# Altium project motor driver.PrjPcb
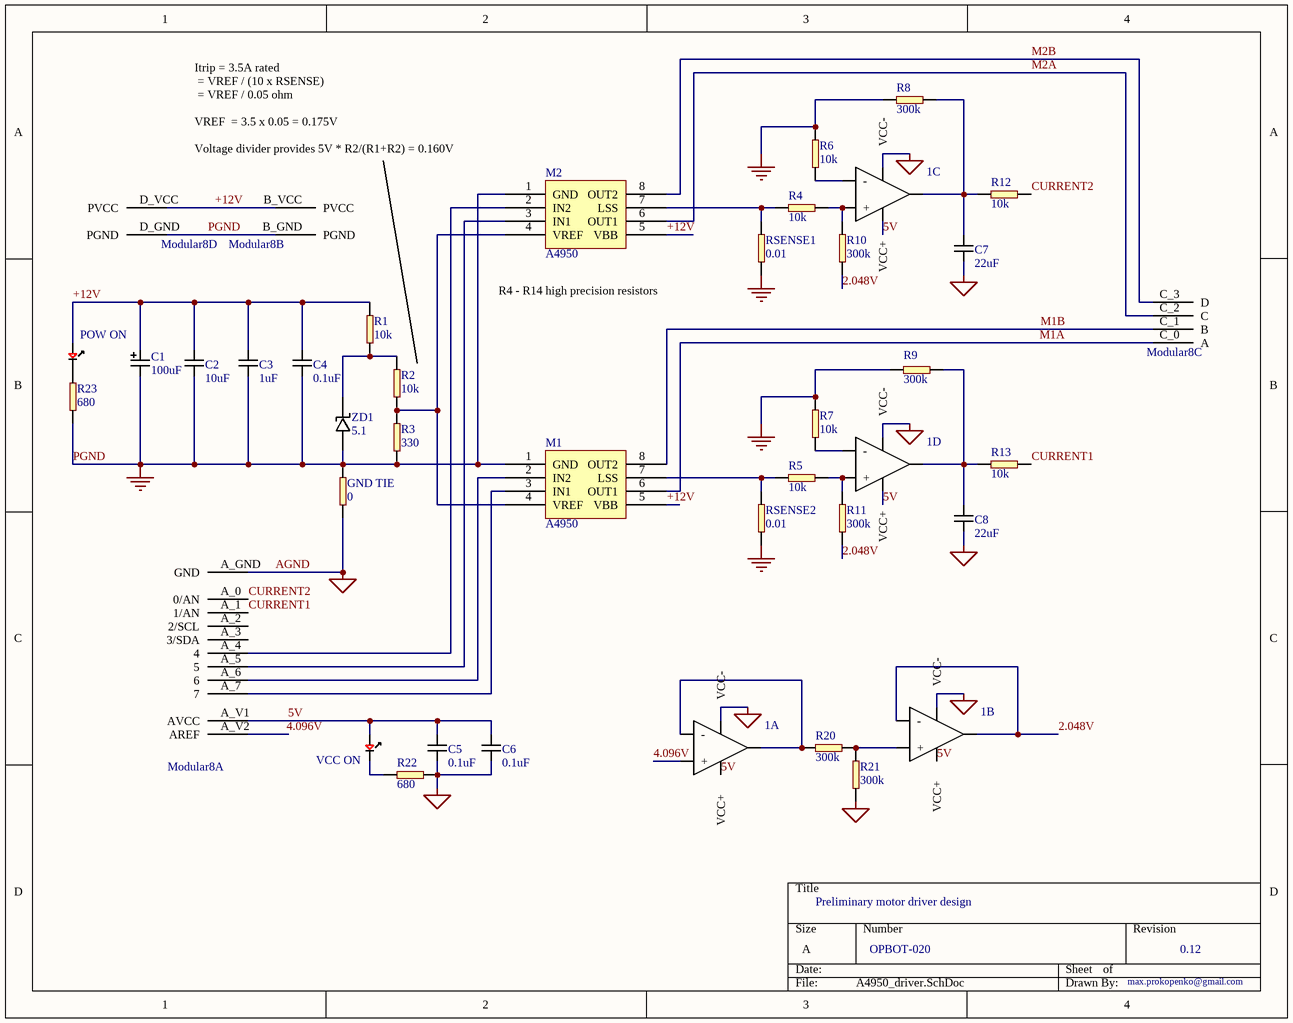
[diagram p0: A4950_driver.SchDoc]
1 sheet, 35 parts. Net scope: global (net labels, ports and power ports of the same name join across sheets).
Board file: motor_driver_002.PcbDoc

## Sheet A4950_driver.SchDoc
size A

### Parts
1  LM324DT  [SO14]  (value not drawn)  (parts A,B,C,D of 4)
C1  C: 100uF  [RADIAL CAP 6.5mm]  (hidden comment: C 100uF 25V)
C2  C: 10uF  [0603]  (hidden comment: C 10uF 25V)
C3  C: 1uF  [0603]  (hidden comment: C 1uF 25V)
C4  C: 0.1uF  [0603]  (hidden comment: C 0.1uF 25V)
C5  C: 0.1uF  [0603]  (hidden comment: C 0.1uF 25V)
C6  C: 0.1uF  [0603]  (hidden comment: C 0.1uF 25V)
C7  C: 22uF  [0603]  (hidden comment: C 22uF 6.3V)
C8  C: 22uF  [0603]  (hidden comment: C 22uF 6.3V)
GND_TIE  R: 0  [0603]  (hidden comment: R 0)
M1  A4950  [SOICN8 thermal pad]
M2  A4950  [SOICN8 thermal pad]
Modular8  modular8_power  [modular8 metric power]  (value not drawn)  (parts A,B,C,D of 4)
POW_ON  LEDG  [0805 - LED]  (value not drawn)
R1  R: 10k  [0603]  (hidden comment: R 10k)
R2  R: 10k  [0603]  (hidden comment: R 10k)
R3  R: 330  [0603]  (hidden comment: R 330)
R4  R: 10k  [0603]  (hidden comment: R 10k 1%)
R5  R: 10k  [0603]  (hidden comment: R 10k 1%)
R6  R: 10k  [0603]  (hidden comment: R 10k 1%)
R7  R: 10k  [0603]  (hidden comment: R 10k 1%)
R8  R: 300k  [0603]  (hidden comment: R 300k 1%)
R9  R: 300k  [0603]  (hidden comment: R 300k 1%)
R10  R: 300k  [0603]  (hidden comment: R 300k 1%)
R11  R: 300k  [0603]  (hidden comment: R 300k 1%)
R12  R: 10k  [0603]  (hidden comment: R 10k)
R13  R: 10k  [0603]  (hidden comment: R 10k)
R20  R: 300k  [0603]  (hidden comment: R 300k 1%)
R21  R: 300k  [0603]  (hidden comment: R 300k 1%)
R22  R: 680  [0603]  (hidden comment: R 680)
R23  R: 680  [0603]  (hidden comment: R 680)
RSENSE1  R: 0.01  [1206 SPLIT]  (hidden comment: R 0.01 0.5%)
RSENSE2  R: 0.01  [1206 SPLIT]  (hidden comment: R 0.01 0.5%)
VCC_ON  LEDG  [0805 - LED]  (value not drawn)
ZD1  Voltage: 5.1  [SOD-323F]  (hidden comment: Zener 5.1V)

### Nets
AGND: 1.11(VCC-) C5.2 C6.2 C7.2 C8.2 GND_TIE.2 Modular8.A_GND(GND) R21.2 R22.2
PGND: C1.2 C2.2 C3.2 C4.2 GND_TIE.1 M1.1(GND) M2.1(GND) Modular8.B_GND(PGND) Modular8.D_GND(PGND) R3.2 R6.2 R7.2 R8.1 R9.1 R23.2 RSENSE1.2 RSENSE2.2 ZD1.2
2.048V: 1.6(-) 1.7(OUT) R10.2 R11.2
4.096V: 1.3(+) Modular8.A_V2(AREF)
5V: 1.4(VCC+) C5.1 C6.1 Modular8.A_V1(AVCC) VCC_ON.1(A)
+12V: C1.1 C2.1 C3.1 C4.1 M1.5(VBB) M2.5(VBB) Modular8.B_VCC(PVCC) Modular8.D_VCC(PVCC) POW_ON.1(A) R1.1
CURRENT1: Modular8.A_1(1/AN) R13.2
CURRENT2: Modular8.A_0(0/AN) R12.2
M1A: M1.6(OUT1) Modular8.C_0(A)
M1B: M1.8(OUT2) Modular8.C_1(B)
M2A: M2.6(OUT1) Modular8.C_2(C)
M2B: M2.8(OUT2) Modular8.C_3(D)
Net1_1: 1.1(OUT) 1.2(-) R20.2
Net1_5: 1.5(+) R20.1 R21.1
Net1_8: 1.8(OUT) C7.1 R8.2 R12.1
Net1_9: 1.9(-) R6.1
Net1_10: 1.10(+) R4.2 R10.1
Net1_12: 1.12(+) R5.2 R11.1
Net1_13: 1.13(-) R7.1
Net1_14: 1.14(OUT) C8.1 R9.2 R13.1
NetM1_2: M1.2(IN2) Modular8.A_6(6)
NetM1_3: M1.3(IN1) Modular8.A_7(7)
NetM1_4: M1.4(VREF) M2.4(VREF) R2.2 R3.1
NetM1_7: M1.7(LSS) R5.1 RSENSE2.1
NetM2_2: M2.2(IN2) Modular8.A_4(4)
NetM2_3: M2.3(IN1) Modular8.A_5(5)
NetM2_7: M2.7(LSS) R4.1 RSENSE1.1
NetPOW_ON_2: POW_ON.2(K) R23.1
NetR1_2: R1.2 R2.1 ZD1.1
NetR22_1: R22.1 VCC_ON.2(K)

Not connected (* = marked no-connect by the designer): Modular8 A_2(2/SCL) A_3(3/SDA)

### Notes on the sheet
- Itrip	= 3.5A rated
  = VREF / (10 x RSENSE)
  = VREF / 0.05 ohm
  VREF 	= 3.5 x 0.05 = 0.175V
  Voltage divider provides 5V * R2/(R1+R2) = 0.160V
- R4 - R14 high precision resistors
- Preliminary motor driver design
- OPBOT-020
- 0.12
- max.prokopenko@gmail.com

### Library data of the parts
1 = LM324DT: Supplier 1: Digi-Key; Supplier Part Number 1: 497-1580-1-ND
C1 = C 100uF 25V: Supplier 1: Digi-Key; Supplier Part Number 1: PCE3898CT-ND; Supplier 2: Allied; Supplier Part Number 2: 70257965
C2 = C 10uF 25V: Supplier 1: Digi-Key; Supplier Part Number 1: 445-9015-1-ND
C3 = C 1uF 25V: Supplier 1: Digi-Key; Supplier Part Number 1: 1276-1858-1-ND
C4-C6 = C 0.1uF 25V: Supplier 1: Digi-Key; Supplier Part Number 1: 445-1316-1-ND
C7 C8 = C 22uF 6.3V: Supplier 1: Digi-Key; Supplier Part Number 1: 1276-1193-1-ND
GND_TIE = R 0: Supplier 1: Digi-Key; Supplier Part Number 1: RHM0.0GCT-ND
M1 M2 = A4950: Supplier 1: Digi-Key; Supplier Part Number 1: 620-1400-1-ND
POW_ON VCC_ON = LEDG: Supplier 1: Digi-Key; Supplier Part Number 1: 160-1423-1-ND
R1 R2 R12 R13 = R 10k: Supplier 1: Digi-Key; Supplier Part Number 1: 311-10KGRCT-ND
R3 = R 330: Supplier 1: Digi-Key; Supplier Part Number 1: 311-330GRCT-ND
R4-R7 = R 10k 1%: Supplier 1: Digi-Key; Supplier Part Number 1: 311-10.0KHRCT-ND
R8-R11 R20 R21 = R 300k 1%: Supplier 1: Digi-Key; Supplier Part Number 1: 311-300KHRCT-ND
R22 R23 = R 680: Supplier 1: Digi-Key; Supplier Part Number 1: 311-680GRCT-ND
RSENSE1 RSENSE2 = R 0.01 0.5%: Supplier 1: Digi-Key; Supplier Part Number 1: LVK12R010DERCT-ND
ZD1 = Zener 5.1V: Supplier 1: Digi-Key; Supplier Part Number 1: UDZ5V1BF-7DICT-ND